# Altium schematic sheet Sensors.SchDoc
size B; SheetNumber: 2; SheetTotal: 4
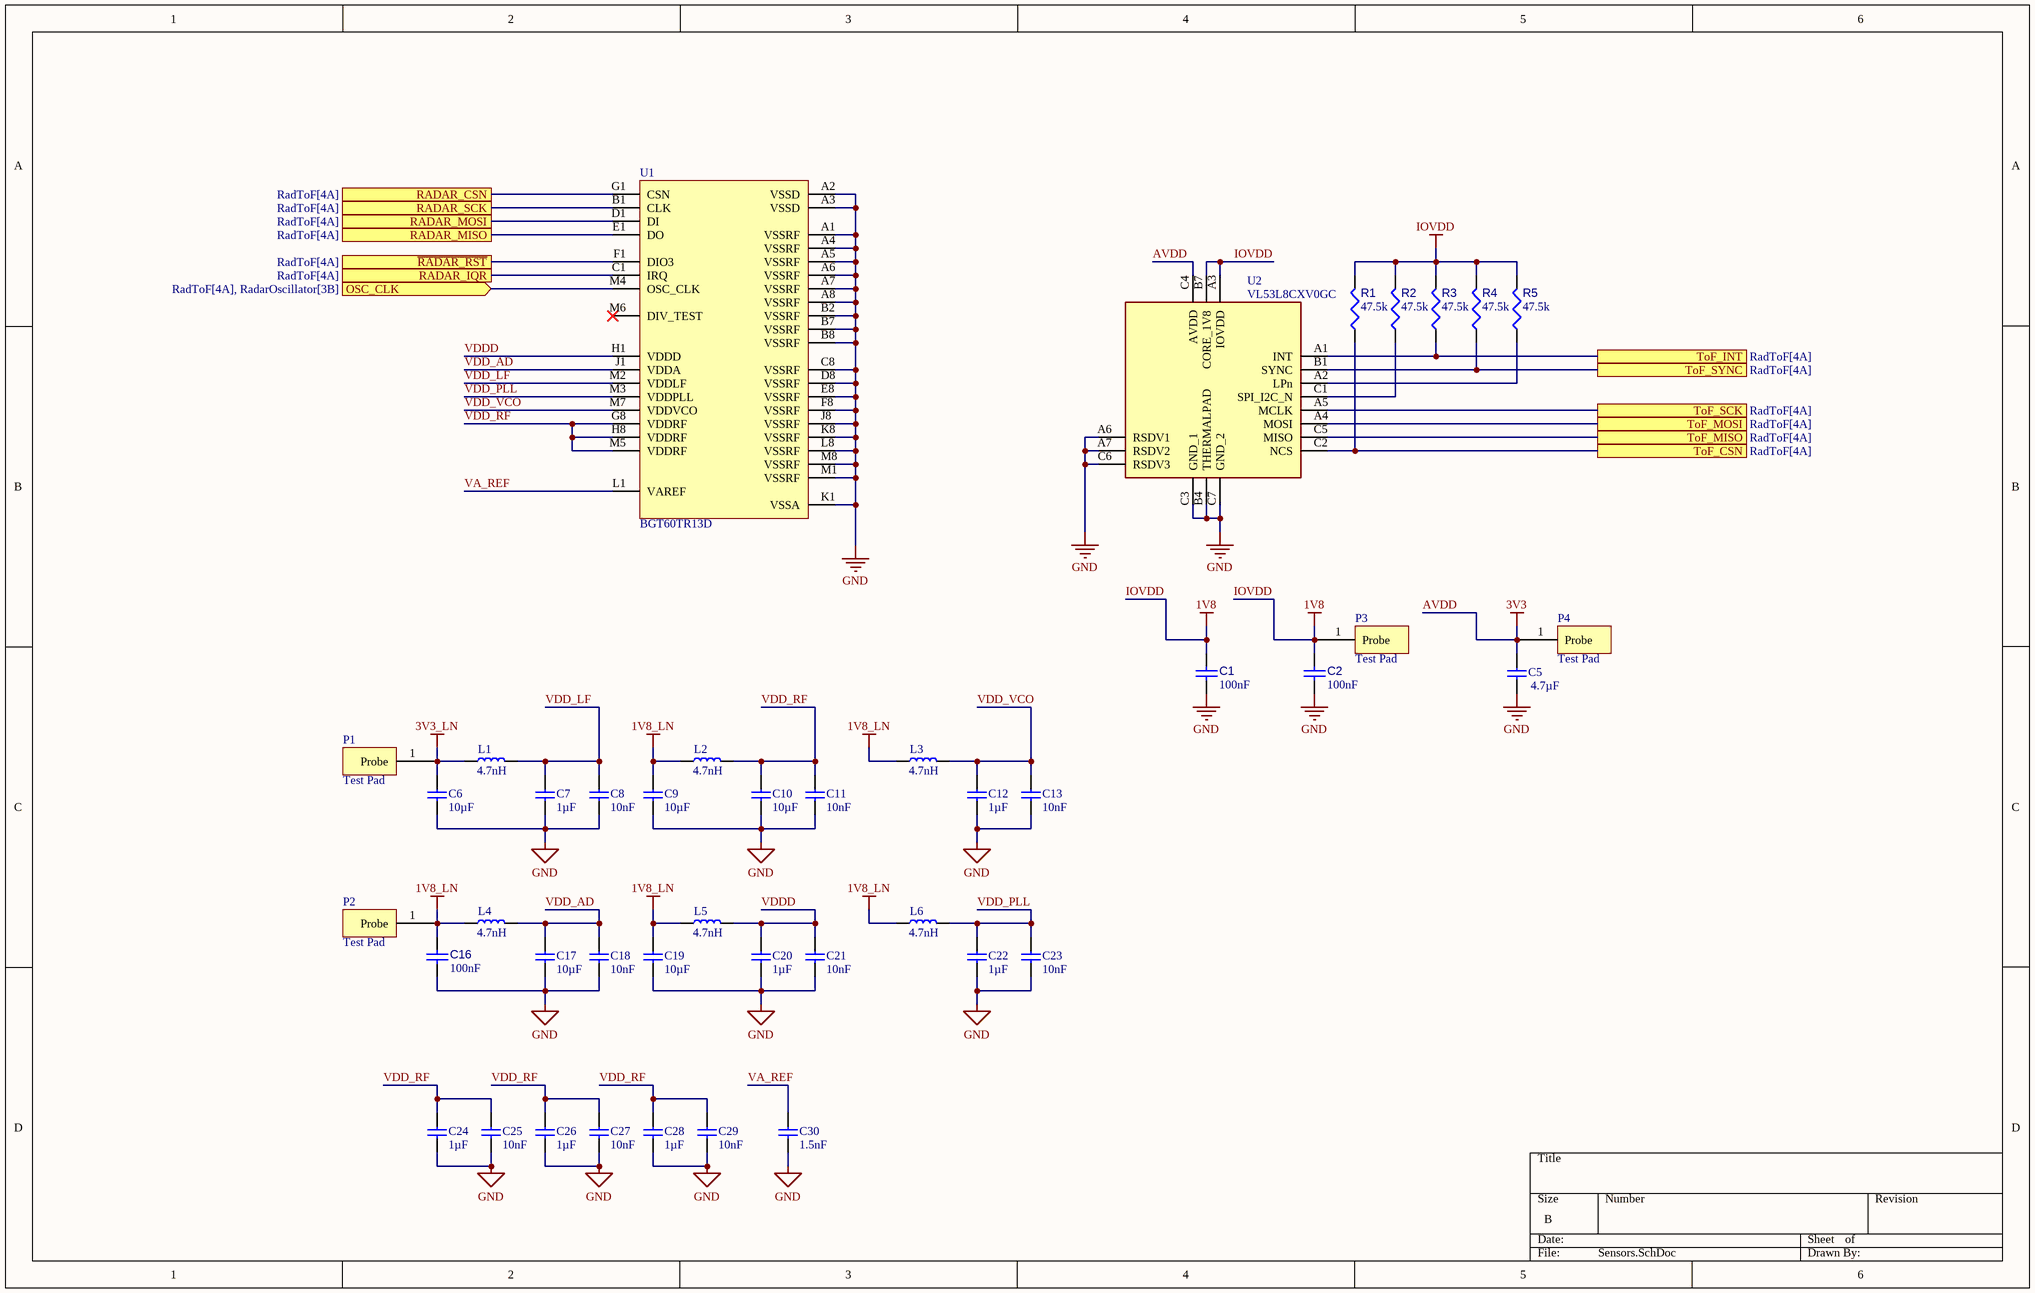
[diagram p0: Sensors.SchDoc]

## Parts
C1  value 100nF  [CAPC0402(1005)60_L]  (hidden comment: Capacitor 100nF +/-20% 50V 0402)
C2  value 100nF  [CAPC0402(1005)60_L]  (hidden comment: Capacitor 100nF +/-20% 50V 0402)
C5  value 4.7µF  [CAP0201]  (hidden comment: C_GRM035R60J475ME15D)
C6  value 10µF  [CAP0402]  (hidden comment: C_GRM155R61A106ME11D)
C7  value 1µF  [CAP0402]  (hidden comment: C_GRM155R61E105KA12J)
C8  value 10nF  [CAP0201]  (hidden comment: C_GRM033R70J103JA01D)
C9  value 10µF  [CAP0402]  (hidden comment: C_GRM155R61A106ME11D)
C10  value 10µF  [CAP0402]  (hidden comment: C_GRM155R61A106ME11D)
C11  value 10nF  [CAP0201]  (hidden comment: C_GRM033R70J103JA01D)
C12  value 1µF  [CAP0402]  (hidden comment: C_GRM155R61E105KA12J)
C13  value 10nF  [CAP0201]  (hidden comment: C_GRM033R70J103JA01D)
C16  value 100nF  [CAPC0402(1005)60_L]  (hidden comment: Capacitor 100nF +/-20% 50V 0402)
C17  value 10µF  [CAP0402]  (hidden comment: C_GRM155R61A106ME11D)
C18  value 10nF  [CAP0201]  (hidden comment: C_GRM033R70J103JA01D)
C19  value 10µF  [CAP0402]  (hidden comment: C_GRM155R61A106ME11D)
C20  value 1µF  [CAP0402]  (hidden comment: C_GRM155R61E105KA12J)
C21  value 10nF  [CAP0201]  (hidden comment: C_GRM033R70J103JA01D)
C22  value 1µF  [CAP0402]  (hidden comment: C_GRM155R61E105KA12J)
C23  value 10nF  [CAP0201]  (hidden comment: C_GRM033R70J103JA01D)
C24  value 1µF  [CAP0402]  (hidden comment: C_GRM155R61E105KA12J)
C25  value 10nF  [CAP0201]  (hidden comment: C_GRM033R70J103JA01D)
C26  value 1µF  [CAP0402]  (hidden comment: C_GRM155R61E105KA12J)
C27  value 10nF  [CAP0201]  (hidden comment: C_GRM033R70J103JA01D)
C28  value 1µF  [CAP0402]  (hidden comment: C_GRM155R61E105KA12J)
C29  value 10nF  [CAP0201]  (hidden comment: C_GRM033R70J103JA01D)
C30  value 1.5nF  [CAP0402]  (hidden comment: C_GRM155R71H152JA01D)
L1  value 4.7nH  [IND0402]  (hidden comment: L_LQG15WZ4N7B02D)
L2  value 4.7nH  [IND0402]  (hidden comment: L_LQG15WZ4N7B02D)
L3  value 4.7nH  [IND0402]  (hidden comment: L_LQG15WZ4N7B02D)
L4  value 4.7nH  [IND0402]  (hidden comment: L_LQG15WZ4N7B02D)
L5  value 4.7nH  [IND0402]  (hidden comment: L_LQG15WZ4N7B02D)
L6  value 4.7nH  [IND0402]  (hidden comment: L_LQG15WZ4N7B02D)
P1  Test Pad  [test pad]
P2  Test Pad  [test pad]
P3  Test Pad  [test pad]
P4  Test Pad  [test pad]
R1  value 47.5k  [RESC0402(1005)_L]  (hidden comment: Resistor 47K5 +/-1 % 0402 63 mW)
R2  value 47.5k  [RESC0402(1005)_L]  (hidden comment: Resistor 47K5 +/-1 % 0402 63 mW)
R3  value 47.5k  [RESC0402(1005)_L]  (hidden comment: Resistor 47K5 +/-1 % 0402 63 mW)
R4  value 47.5k  [RESC0402(1005)_L]  (hidden comment: Resistor 47K5 +/-1 % 0402 63 mW)
R5  value 47.5k  [RESC0402(1005)_L]  (hidden comment: Resistor 47K5 +/-1 % 0402 63 mW)
U1  BGT60TR13D  [BGT60TR13D]
U2  VL53L8CXV0GC  [VL53L8CXV0GC1]

## Ports
OSC_CLK (in, see RadToF[4A], RadarOscillator[3B]), RADAR_CSN (see RadToF[4A]), RADAR_IQR (see RadToF[4A]), RADAR_MISO (see RadToF[4A]), RADAR_MOSI (see RadToF[4A]), RADAR_SCK (see RadToF[4A]), ToF_CSN (see RadToF[4A]), ToF_INT (see RadToF[4A]), ToF_MISO (see RadToF[4A]), ToF_MOSI (see RadToF[4A]), ToF_SCK (see RadToF[4A]), ToF_SYNC (see RadToF[4A]), ~{RADAR_RST} (see RadToF[4A])

## Nets
1V8_LN: C9.2 C16.1 C19.2 L2.1 L3.1 L4.1 L5.1 L6.1 P2.1(Probe)
3V3_LN: C6.2 L1.1 P1.1(Probe)
AVDD: C5.2 P4.1(Probe) U2.C4(AVDD)  [also labelled 3V3]
GND: C1.2 C2.2 C5.1 C6.1 C7.1 C8.1 C9.1 C10.1 C11.1 C12.1 C13.1 C16.2 C17.1 C18.1 C19.1 C20.1 C21.1 C22.1 C23.1 C24.1 C25.1 C26.1 C27.1 C28.1 C29.1 C30.1 U1.A1(VSSRF) U1.A2(VSSD) U1.A3(VSSD) U1.A4(VSSRF) U1.A5(VSSRF) U1.A6(VSSRF) U1.A7(VSSRF) U1.A8(VSSRF) U1.B2(VSSRF) U1.B7(VSSRF) U1.B8(VSSRF) U1.C8(VSSRF) U1.D8(VSSRF) U1.E8(VSSRF) U1.F8(VSSRF) U1.J8(VSSRF) U1.K1(VSSA) U1.K8(VSSRF) U1.L8(VSSRF) U1.M1(VSSRF) U1.M8(VSSRF) U2.A6(RSDV1) U2.A7(RSDV2) U2.B4(THERMALPAD) U2.C3(GND_1) U2.C6(RSDV3) U2.C7(GND_2)
IOVDD: C1.1 C2.1 P3.1(Probe) R1.2 R2.2 R3.2 R4.2 R5.2 U2.A3(IOVDD) U2.B7(CORE_1V8)  [also labelled 1V8]
OSC_CLK: U1.M4(OSC_CLK) ; port OSC_CLK
~{RADAR_RST}: U1.F1(DIO3) ; port ~{RADAR_RST}
RADAR_CSN: U1.G1(CSN) ; port RADAR_CSN
RADAR_IQR: U1.C1(IRQ) ; port RADAR_IQR
RADAR_MISO: U1.E1(DO) ; port RADAR_MISO
RADAR_MOSI: U1.D1(DI) ; port RADAR_MOSI
RADAR_SCK: U1.B1(CLK) ; port RADAR_SCK
ToF_CSN: R1.1 U2.C2(NCS) ; port ToF_CSN
ToF_INT: R3.1 U2.A1(INT) ; port ToF_INT
ToF_MISO: U2.C5(MISO) ; port ToF_MISO
ToF_MOSI: U2.A4(MOSI) ; port ToF_MOSI
ToF_SCK: U2.A5(MCLK) ; port ToF_SCK
ToF_SYNC: R4.1 U2.B1(SYNC) ; port ToF_SYNC
VA_REF: C30.2 U1.L1(VAREF)
VDD_AD: C17.2 C18.2 L4.2 U1.J1(VDDA)
VDD_LF: C7.2 C8.2 L1.2 U1.M2(VDDLF)
VDD_PLL: C22.2 C23.2 L6.2 U1.M3(VDDPLL)
VDD_RF: C10.2 C11.2 C24.2 C25.2 C26.2 C27.2 C28.2 C29.2 L2.2 U1.G8(VDDRF) U1.H8(VDDRF) U1.M5(VDDRF)
VDD_VCO: C12.2 C13.2 L3.2 U1.M7(VDDVCO)
VDDD: C20.2 C21.2 L5.2 U1.H1(VDDD)
NetR2_1: R2.1 U2.C1(SPI_I2C_N)
NetR5_1: R5.1 U2.A2(LPn)

Not connected (* = marked no-connect by the designer): U1 M6(DIV_TEST)*

## Library data of the parts
C1 C2 C16 = CMP-001-00067-3: Chip Capacitor, 100nF +/-20%, 50V, 0402, Thickness 0.6 mm; Tolerance: 10%; Min Operating Temperature: -55°C; Pins: 2; Case/Package: 0402; Max Operating Temperature: 85°C; Voltage Rating: 50V; Mounting Technology: SMT
C5 = CMP-001-00094-1: CAP CER  4.7uF 6.3V X5R 0201; Manufacturer: Murata; Tolerance: 20%; ComponentLink2URL: http://search.murata.co.jp/Ceramy/image/img/A01X/G101/ENG/GRM035R60J475ME15-01.pdf?src-supplier=Digi-Key; RoHS: Yes; Category: Ceramic Capacitors; Stock 1: 170407; ComponentLink3Description: http://www.farnell.com/datasheets/2853106.pdf?src-supplier=Newark; Min Operating Temperature: -55°C; ComponentLink1Description: http://www.farnell.com/datasheets/2853106.pdf?src-supplier=Farnell; ComponentLink2Description: http://search.murata.co.jp/Ceramy/image/img/A01X/G101/ENG/GRM035R60J475ME15-01.pdf?src-supplier=Digi-Key; ComponentLink3URL: http://www.farnell.com/datasheets/2853106.pdf?src-supplier=Newark; Length: 0.024inch; Width: 0.012inch; Pricing 1: 1=0.42000, 10=0.20600, 50=0.20600, 100=0.17700, 1000=0.11200, 10000=0.09400 (USD); Dielectric: X5R; Voltage Rating (DC): 6.3V; ComponentLink1URL: http://www.farnell.com/datasheets/2853106.pdf?src-supplier=Farnell; RoHS Compliant: Yes; Voltage Rating: 6.3V; Design Item ID: C_GRM035R60J475ME15D; Thickness: 0.022inch; Packaging: Tape and Reel; Manufacturer Part Number: GRM035R60J475ME15D; Case Code (Metric): 0603; Source: schuluka.SchLib; Mount: Surface Mount; Case/Package: 0201; Max Operating Temperature: 85°C
C6 C9 C10 C17 C19 = CMP-001-00100-1: CAP CER  10uF 10V X5R 20% 0402; Manufacturer: Murata Electronics; Part Number: GRM033R70J103JA01D; Manufacturer Part Number: GRM155R71H103KA88D; Tolerance: 5%; Rated DC Voltage (URdc): 50V; Voltage - Rated: 6.3V; Temperature Coefficient: X7R; Dielectric Material: Ceramic; Negative Tolerance: 10%; Multilayer: Yes; ComponentLink6Description: https://datasheet.ciiva.com/129/product-129810.pdf?src-supplier=Digi-Key; ComponentLink2URL: http://digikey.com/product-detail/en/murata-electronics/GRM033R70J103JA01D/490-16599-1-ND/7595523; Size / Dimension: 0.024" L x 0.012" W (0.60mm x 0.30mm); Lifecycle Status: Active; Terminal Finish: Nickel; ComponentLink12URL: https://datasheet.ciiva.com/5410/product-5410990.pdf?src-supplier=Mouser; Category: Ceramic Capacitors; ComponentLink9URL: https://datasheet.ciiva.com/29199/454225-da-01-en-vs-kondensator-0402-29199740.pdf?src-supplier=Conrad; ComponentLink2Description: DigiKey Link; ComponentLink13Description: https://datasheet.ciiva.com/16495/product-16495290.pdf?src-supplier=Future+Electronics; ComponentLink11Description: https://datasheet.ciiva.com/129/grm155r71h103ka88-01-129812.pdf?src-supplier=Digi-Key; Series: GRM; Source: schuluka.SchLib; ComponentLink8URL: https://datasheet.ciiva.com/18100/getdatasheetpartid-27434-18100660.pdf?src-supplier=Verical; Min Operating Temperature: -55°C; ComponentLink1Description: Datasheet; Thickness (Max): 0.013" (0.33mm); ComponentLink10Description: https://datasheet.ciiva.com/129/grm155r71h103ka88-01-129811.pdf?src-supplier=Digi-Key; Device Package: 0201 (0603 Metric); RoHS Compliant: Yes; Max Operating Temperature: 125°C; Termination: Wraparound; ComponentLink14URL: https://datasheet.ciiva.com:443/pdfs/VipMasterIC/IC/MURE/MURE-S-A0006500741/MURE-S-A0006500741-1.pdf?src-supplier=IHS+Markit; ComponentLink11URL: https://datasheet.ciiva.com/129/grm155r71h103ka88-01-129812.pdf?src-supplier=Digi-Key; ComponentLink5URL: https://datasheet.ciiva.com/19476/1856433-19476546.pdf?src-supplier=Jameco; Width: 0.5mm; Pricing 2: 1=0.17000, 10=0.12400, 50=0.07060, 100=0.05840, 500=0.04098, 1000=0.03392, 2500=0.03157, 5000=0.02888 (USD); ComponentLink6URL: https://datasheet.ciiva.com/129/product-129810.pdf?src-supplier=Digi-Key; ComponentLink13URL: https://datasheet.ciiva.com/16495/product-16495290.pdf?src-supplier=Future+Electronics; Operating Temperature: -55°C ~ 125°C; ComponentLink12Description: https://datasheet.ciiva.com/5410/product-5410990.pdf?src-supplier=Mouser; Stock 1: 3320653; ComponentLink7Description: https://datasheet.ciiva.com/11786/0900766b80ef921d-11786340.pdf?src-supplier=RSComponents; Pins: 2; ComponentLink14Description: https://datasheet.ciiva.com:443/pdfs/VipMasterIC/IC/MURE/MURE-S-A0006500741/MURE-S-A0006500741-1.pdf?src-supplier=IHS+Markit; Length: 1mm; ComponentLink4Description: https://datasheet.ciiva.com/22698/1747449-22698420.pdf?src-supplier=Element14; Part Status: Active; Design Item ID: C_GRM155R61A106ME11D; Price: 0.10; ComponentLink10URL: https://datasheet.ciiva.com/129/grm155r71h103ka88-01-129811.pdf?src-supplier=Digi-Key; Stock 2: 66098; Package / Case: 0201 (0603 Metric); Positive Tolerance: 10%; PartId: 174; JESD-609 Code: e3; Package Style: SMTMeter; Applications: General Purpose; Package Shape: Rectangular; Pricing 1: 1=0.10000, 10=0.03200, 50=0.03200, 100=0.01500, 1000=0.00800, 10000=0.00500 (USD); ComponentLink3Description: https://psearch.en.murata.com:443/capacitor/product/GRM155R71H103KA88%23.pdf?src-supplier=IHS+Markit; RoHS: Yes; Temperature Characteristics Code: X7R; Packaging: CutTape; Minimum Order: 1; Mount: Surface Mount; Capacitor Type: Ceramic; ComponentLink3URL: https://psearch.en.murata.com:443/capacitor/product/GRM155R71H103KA88%23.pdf?src-supplier=IHS+Markit; ComponentLink4URL: https://datasheet.ciiva.com/22698/1747449-22698420.pdf?src-supplier=Element14; REACH SVHC: Yes; Height: 0.5mm; LastUpdated: 02/09/2020 01:00:04; ComponentLink8Description: https://datasheet.ciiva.com/18100/getdatasheetpartid-27434-18100660.pdf?src-supplier=Verical; Size Code: 0402; Reach SVHC Compliant: Yes; ComponentLink5Description: https://datasheet.ciiva.com/19476/1856433-19476546.pdf?src-supplier=Jameco; ComponentLink7URL: https://datasheet.ciiva.com/11786/0900766b80ef921d-11786340.pdf?src-supplier=RSComponents; ComponentLink1URL: https://search.murata.co.jp/Ceramy/image/img/A01X/G101/ENG/GRM033R70J103JA01-01.pdf; ComponentLink9Description: https://datasheet.ciiva.com/29199/454225-da-01-en-vs-kondensator-0402-29199740.pdf?src-supplier=Conrad; Mounting Type: Surface Mount, MLCC
C7 C12 C20 C22 C24 C26 C28 = CMP-001-00102-1: CAP CER 1uF 25V X5R 0402; Manufacturer Part Number: GRM033R61A105ME15D; Manufacturer: Murata; Positive Tolerance: 10%; Voltage Rating (DC): 10V; Dielectric Material: Ceramic; Multilayer: Yes; Tolerance: 20%; Pricing 1: 1=0.18000, 10=0.08400, 50=0.08400, 100=0.03800, 1000=0.02100, 10000=0.01600 (USD); Pins: 2; Termination: Wraparound; Thickness: 0.015inch; Case Code (Metric): 0603; Packaging: Tape and Reel; Temperature Characteristics Code: X5R; Package Shape: Rectangular; ComponentLink2Description: https://datasheet.ciiva.com:443/pdfs/VipMasterIC/IC/MURE/MURE-S-A0004362469/MURE-S-A0004364524-1.pdf?src-supplier=IHS+Markit; ComponentLink1URL: http://search.murata.co.jp/Ceramy/image/img/A01X/G101/ENG/GRM033R61A105ME15-01.pdf?src-supplier=Digi-Key; Case/Package: 0201; Terminal Finish: Nickel; Height: 0.5mm; ComponentLink2URL: https://datasheet.ciiva.com:443/pdfs/VipMasterIC/IC/MURE/MURE-S-A0004362469/MURE-S-A0004364524-1.pdf?src-supplier=IHS+Markit; ComponentLink3URL: http://search.murata.co.jp/Ceramy/image/img/A01X/G101/ENG/GRM155R61E105KA12-01.pdf?src-supplier=Digi-Key; Size Code: 0402; Source: schuluka.SchLib; Max Operating Temperature: 85°C; Category: Ceramic Capacitors; Width: 0.012inch; REACH SVHC: Yes; Min Operating Temperature: -55°C; Dielectric: X5R; ComponentLink3Description: http://search.murata.co.jp/Ceramy/image/img/A01X/G101/ENG/GRM155R61E105KA12-01.pdf?src-supplier=Digi-Key; Mount: Surface Mount; Rated DC Voltage (URdc): 25V; Stock 1: 645001; Voltage Rating: 10V; RoHS Compliant: Yes; Design Item ID: C_GRM155R61E105KA12J; Capacitor Type: Ceramic; JESD-609 Code: e3; RoHS: Yes; ComponentLink1Description: http://search.murata.co.jp/Ceramy/image/img/A01X/G101/ENG/GRM033R61A105ME15-01.pdf?src-supplier=Digi-Key; Package Style: SMTMeter; Negative Tolerance: 10%; Length: 0.024inch
C8 C11 C13 C18 C21 C23 C25 C27 C29 = CMP-001-00093-1: CAP CER 10nF 6.3V X7R 0201; Manufacturer: Murata Electronics; Tolerance: 5%; Size / Dimension: 0.024" L x 0.012" W (0.60mm x 0.30mm); Mounting Type: Surface Mount, MLCC; Package / Case: 0201 (0603 Metric); ComponentLink2URL: http://digikey.com/product-detail/en/murata-electronics/GRM033R70J103JA01D/490-16599-1-ND/7595523; Series: GRM; Lifecycle Status: Active; LastUpdated: 02/09/2020 01:00:04; Operating Temperature: -55°C ~ 125°C; Temperature Coefficient: X7R; Device Package: 0201 (0603 Metric); ComponentLink2Description: DigiKey Link; PartId: 174; Minimum Order: 1; Design Item ID: C_GRM033R70J103JA01D; ComponentLink1URL: https://search.murata.co.jp/Ceramy/image/img/A01X/G101/ENG/GRM033R70J103JA01-01.pdf; Applications: General Purpose; Source: schuluka.SchLib; Thickness (Max): 0.013" (0.33mm); Voltage - Rated: 6.3V; Part Status: Active; Price: 0.10; Packaging: CutTape; Part Number: GRM033R70J103JA01D; ComponentLink1Description: Datasheet
C30 = CMP-001-00106-1: CAP CER 1.5nF 50V X7R 0402; Manufacturer Part Number: GRM155R71H103KA88D; Part Number: GRM033R70J103JA01D; Manufacturer: Murata Electronics; Dielectric Material: Ceramic; Tolerance: 5%; Multilayer: Yes; Positive Tolerance: 10%; Voltage - Rated: 6.3V; ComponentLink18URL: https://datasheet.ciiva.com/22698/1666664-22698413.pdf?src-supplier=Element14; Height: 0.5mm; ComponentLink19Description: https://datasheet.ciiva.com:443/pdfs/VipMasterIC/IC/MURE/MURE-S-A0004362469/MURE-S-A0004364764-1.pdf?src-supplier=IHS+Markit; ComponentLink10Description: https://datasheet.ciiva.com/129/grm155r71h103ka88-01-129811.pdf?src-supplier=Digi-Key; Operating Temperature: -55°C ~ 125°C; ComponentLink1Description: Datasheet; Category: Ceramic Capacitors; ComponentLink20Description: https://datasheet.ciiva.com/11786/0900766b80ef921d-11786293.pdf?src-supplier=RSComponents; ComponentLink15Description: http://search.murata.co.jp/Ceramy/image/img/A01X/G101/ENG/GRM155C71H104KE19-01A.pdf?src-supplier=Digi-Key; Mount: Surface Mount; ComponentLink27URL: https://datasheet.ciiva.com/11621/c02e-11621310.pdf?src-supplier=Avnet; Package Style: SMTMeter; ComponentLink26Description: https://datasheet.ciiva.com/11621/c02e-11621311.pdf?src-supplier=Avnet; Size / Dimension: 0.024" L x 0.012" W (0.60mm x 0.30mm); Pricing 1: 1=0.10000, 10=0.03600, 50=0.03600, 100=0.02900, 1000=0.01700, 10000=0.01100 (USD); Applications: General Purpose; ComponentLink4URL: https://datasheet.ciiva.com/22698/1747449-22698420.pdf?src-supplier=Element14; ComponentLink22URL: https://datasheet.ciiva.com/18184/getdatasheetpartid-199945-18184719.pdf?src-supplier=Verical; Length: 1mm; Termination: Wraparound; Package Shape: Rectangular; ComponentLink14Description: https://datasheet.ciiva.com:443/pdfs/VipMasterIC/IC/MURE/MURE-S-A0004362469/MURE-S-A0004364249-1.pdf?src-supplier=IHS+Markit; ComponentLink25URL: https://datasheet.ciiva.com/6263/partnumbering-e-01-6263757.pdf?src-supplier=Digi-Key; Temperature Characteristics Code: X7R; ComponentLink7Description: https://datasheet.ciiva.com/11786/0900766b80ef921d-11786340.pdf?src-supplier=RSComponents; ComponentLink2Description: DigiKey Link; ComponentLink16URL: https://datasheet.ciiva.com:443/pdfs/VipMasterIC/IC/MURE/MURE-S-A0004362469/MURE-S-A0004364633-1.pdf?src-supplier=IHS+Markit; ComponentLink6URL: https://datasheet.ciiva.com/129/product-129810.pdf?src-supplier=Digi-Key; ComponentLink20URL: https://datasheet.ciiva.com/11786/0900766b80ef921d-11786293.pdf?src-supplier=RSComponents; ComponentLink21Description: https://datasheet.ciiva.com/5418/product-5418208.pdf?src-supplier=Mouser; Price: 0.10; ComponentLink5URL: https://datasheet.ciiva.com/19476/1856433-19476546.pdf?src-supplier=Jameco; ComponentLink8URL: https://datasheet.ciiva.com/18100/getdatasheetpartid-27434-18100660.pdf?src-supplier=Verical; ComponentLink16Description: https://datasheet.ciiva.com:443/pdfs/VipMasterIC/IC/MURE/MURE-S-A0004362469/MURE-S-A0004364633-1.pdf?src-supplier=IHS+Markit; Part Status: Active; ComponentLink12URL: https://datasheet.ciiva.com/5410/product-5410990.pdf?src-supplier=Mouser; ComponentLink11Description: https://datasheet.ciiva.com/129/grm155r71h103ka88-01-129812.pdf?src-supplier=Digi-Key; ComponentLink13Description: https://datasheet.ciiva.com/16495/product-16495290.pdf?src-supplier=Future+Electronics; ComponentLink6Description: https://datasheet.ciiva.com/129/product-129810.pdf?src-supplier=Digi-Key; Minimum Order: 1; Device Package: 0201 (0603 Metric); ComponentLink22Description: https://datasheet.ciiva.com/18184/getdatasheetpartid-199945-18184719.pdf?src-supplier=Verical; Packaging: CutTape; ComponentLink2URL: http://digikey.com/product-detail/en/murata-electronics/GRM033R70J103JA01D/490-16599-1-ND/7595523; Series: GRM; ComponentLink4Description: https://datasheet.ciiva.com/22698/1747449-22698420.pdf?src-supplier=Element14; ComponentLink26URL: https://datasheet.ciiva.com/11621/c02e-11621311.pdf?src-supplier=Avnet; ComponentLink9URL: https://datasheet.ciiva.com/29199/454225-da-01-en-vs-kondensator-0402-29199740.pdf?src-supplier=Conrad; ComponentLink8Description: https://datasheet.ciiva.com/18100/getdatasheetpartid-27434-18100660.pdf?src-supplier=Verical; Package / Case: 0201 (0603 Metric); Mounting Type: Surface Mount, MLCC; ComponentLink10URL: https://datasheet.ciiva.com/129/grm155r71h103ka88-01-129811.pdf?src-supplier=Digi-Key; JESD-609 Code: e3; ComponentLink23URL: https://datasheet.ciiva.com/6263/partnumbering-e-01-6263756.pdf?src-supplier=Digi-Key; Design Item ID: C_GRM155R71H152JA01D; ComponentLink28Description: https://datasheet.ciiva.com:443/pdfs/VipMasterIC/IC/MURE/MURE-S-A0004362469/MURE-S-A0004364879-1.pdf?src-supplier=IHS+Markit; ComponentLink28URL: https://datasheet.ciiva.com:443/pdfs/VipMasterIC/IC/MURE/MURE-S-A0004362469/MURE-S-A0004364879-1.pdf?src-supplier=IHS+Markit; Lifecycle Status: Active; Rated DC Voltage (URdc): 50V; Stock 1: 1915648; ComponentLink24Description: https://datasheet.ciiva.com/6263/partnumbering-e-01-6263755.pdf?src-supplier=Digi-Key; ComponentLink13URL: https://datasheet.ciiva.com/16495/product-16495290.pdf?src-supplier=Future+Electronics; ComponentLink17URL: https://datasheet.ciiva.com/7719/1666664-7719007.pdf?src-supplier=Element14; ComponentLink17Description: https://datasheet.ciiva.com/7719/1666664-7719007.pdf?src-supplier=Element14; Pricing 2: 1=0.10000, 10=0.03100, 50=0.01720, 100=0.01400, 500=0.01000, 1000=0.00786, 2500=0.00715, 5000=0.00658 (USD); Source: schuluka.SchLib; ComponentLink24URL: https://datasheet.ciiva.com/6263/partnumbering-e-01-6263755.pdf?src-supplier=Digi-Key; Capacitor Type: Ceramic; ComponentLink9Description: https://datasheet.ciiva.com/29199/454225-da-01-en-vs-kondensator-0402-29199740.pdf?src-supplier=Conrad; ComponentLink1URL: https://search.murata.co.jp/Ceramy/image/img/A01X/G101/ENG/GRM033R70J103JA01-01.pdf; RoHS: Yes; Reach SVHC Compliant: Yes; REACH SVHC: Yes; ComponentLink29URL: https://datasheet.ciiva.com/5417/product-5417527.pdf?src-supplier=Mouser; ComponentLink7URL: https://datasheet.ciiva.com/11786/0900766b80ef921d-11786340.pdf?src-supplier=RSComponents; ComponentLink21URL: https://datasheet.ciiva.com/5418/product-5418208.pdf?src-supplier=Mouser; ComponentLink23Description: https://datasheet.ciiva.com/6263/partnumbering-e-01-6263756.pdf?src-supplier=Digi-Key; RoHS Compliant: Yes; Pins: 2; Size Code: 0402; Terminal Finish: Nickel; ComponentLink18Description: https://datasheet.ciiva.com/22698/1666664-22698413.pdf?src-supplier=Element14; ComponentLink12Description: https://datasheet.ciiva.com/5410/product-5410990.pdf?src-supplier=Mouser; ComponentLink19URL: https://datasheet.ciiva.com:443/pdfs/VipMasterIC/IC/MURE/MURE-S-A0004362469/MURE-S-A0004364764-1.pdf?src-supplier=IHS+Markit; ComponentLink27Description: https://datasheet.ciiva.com/11621/c02e-11621310.pdf?src-supplier=Avnet; Stock 2: 358031; Temperature Coefficient: X7R; ComponentLink11URL: https://datasheet.ciiva.com/129/grm155r71h103ka88-01-129812.pdf?src-supplier=Digi-Key; ComponentLink5Description: https://datasheet.ciiva.com/19476/1856433-19476546.pdf?src-supplier=Jameco; Negative Tolerance: 10%; Thickness (Max): 0.013" (0.33mm); ComponentLink14URL: https://datasheet.ciiva.com:443/pdfs/VipMasterIC/IC/MURE/MURE-S-A0004362469/MURE-S-A0004364249-1.pdf?src-supplier=IHS+Markit; ComponentLink15URL: http://search.murata.co.jp/Ceramy/image/img/A01X/G101/ENG/GRM155C71H104KE19-01A.pdf?src-supplier=Digi-Key; PartId: 174; Min Operating Temperature: -55°C; LastUpdated: 02/09/2020 01:00:04; Max Operating Temperature: 125°C; ComponentLink3URL: https://psearch.en.murata.com:443/capacitor/product/GRM155R71H103KA88%23.pdf?src-supplier=IHS+Markit; ComponentLink29Description: https://datasheet.ciiva.com/5417/product-5417527.pdf?src-supplier=Mouser; Width: 0.5mm; ComponentLink3Description: https://psearch.en.murata.com:443/capacitor/product/GRM155R71H103KA88%23.pdf?src-supplier=IHS+Markit; ComponentLink25Description: https://datasheet.ciiva.com/6263/partnumbering-e-01-6263757.pdf?src-supplier=Digi-Key
L1-L6 = CMP-006-00029-1: IND 4.7nH 800mA 110 mOHM 0402; Part Number: LQW15AN22NJ8ZD; Manufacturer Part Number: LQG15WH2N2B02D; Manufacturer: Murata Electronics; Test Frequency: 100MHz; Shape/Size Description: RECTANGULAR PACKAGE; Inductor Type: GENERAL PURPOSE INDUCTOR; Shielding: Unshielded; Quality Factor-Min (at L-nom): 23; Type: Wirewound; Frequency - Self Resonant: 4.5GHz; Inductance-Nom (L): 0.0047uH; Number of Functions: 1; Self Resonant Frequency: 5GHz; Tolerance: 5%; Material - Core: Non-Magnetic; Reference Standard: AEC-Q200; Inductor Application: RF INDUCTOR; Q @ Freq: 30 @ 250MHz; Current Rating (Amps): 780mA; DC Resistance (DCR): 202mOhm Max; Pins: 2; Ratings: AEC-Q200; Package / Case: 0402 (1005 Metric); Part Status: Active; ComponentLink1URL: https://search.murata.co.jp/Ceramy/image/img/P02/JELF243A-9138.pdf; Operating Temperature: -55°C ~ 125°C; Series: LQW15; RoHS: Yes; Packaging: TapeAndReel; Pricing 2: 1=0.28000, 10=0.24800, 50=0.24800, 100=0.17000, 1000=0.11400, 10000=0.08700 (USD); Price: 0.07; ComponentLink2Description: DigiKey Link; ComponentLink1Description: Datasheet; Surface Mount: Yes; PartId: 1422; Max Operating Temperature: 125°C; Mounting Type: Surface Mount; LastUpdated: 02/09/2020 01:24:27; Inductance Frequency - Test: 100MHz; ComponentLink2URL: http://digikey.com/product-detail/en/murata-electronics/LQW15AN22NJ8ZD/490-15364-1-ND/6800029; Source: schuluka.SchLib; Device Package: 0402 (1005 Metric); Termination: Wraparound; Minimum Order: 1; REACH SVHC: Yes; Category: Fixed Inductors; RoHS Compliant: Yes; Lifecycle Status: Active; Height - Seated (Max): 0.024" (0.60mm); Min Operating Temperature: -55°C; Rated Current-Max: 800mA; Stock 2: 6909; Supplier Device Package: 0402 (1005 Metric); Terminal Placement: Dual Ended; Design Item ID: L_LQG15WZ4N7B02D; Size / Dimension: 0.039" L x 0.024" W (1.00mm x 0.60mm)
R1-R5 = CMP-009-00137-3: Chip Resistor, 47,5 kOhms, +/-1 %, 63 mW, -55 to 155 degC, 0402; Power: 63mW; Tolerance: 1%; Pins: 2; Case/Package: 0402; Min Operating Temperature: -55°C; Max Operating Temperature: 155°C
U1 = SENS_BGT60TR13D: XENSIV 60 GHz radar system platform; Manufacturer: Infineon Technologies; Manufacturer Part Number: BGT61TR13C; OrderNr: EES BGT61TR13C; Value: BGT61TR13C; distributor: Infineon Technologies; PackageReference: BGT61TR13C
U2 = VL53L8CXV0GC: Low-power high-performance 8x8 multizone Time-of-Flight sensor 940 nm, 6.4x3.0x1.75 mm, -30 to 85C; Manufacturer_Name: STMicroelectronics; Manufacturer_Part_Number: VL53L8CXV0GC/1; Geometry.Height: 1.8mm; Mouser Part Number: 511-VL53L8CXV0GC/1; Mouser Price/Stock: https://www.mouser.co.uk/ProductDetail/STMicroelectronics/VL53L8CXV0GC-1?qs=T%252BzbugeAwjhc9idkQC%252BF8g%3D%3D; Arrow Part Number: VL53L8CXV0GC/1; Arrow Price/Stock: https://www.arrow.com/en/products/vl53l8cxv0gc1/stmicroelectronics?region=europe; Datasheet Link: https://www.st.com/resource/en/datasheet/vl53l8cx.pdf